# Altium schematic sheet VCO_core.SchDoc
size A3; Organization: Medical Technologies CZ a.s.; Version1: N/A; Version2: N/A; Version3: N/A; Change1description: N/A; Change2description: N/A; Change3description: N/A; Change1DrawnBy: N/A; Change2DrawnBy: N/A; Change3DrawnBy: N/A; Change1CheckedBy: N/A; Change2CheckedBy: N/A; Change3CheckedBy: N/A; PreviusVersion_Chng1: N/A; PreviusVersion_Chng2: N/A; PreviusVersion_Chng3: N/A; Variant1description: Standard assembly; Variant2description: N/A; Variant3description: N/A; Variant4description: N/A; PrimaryCard1: XXXxxxXXX; PrimaryCard2: N/A; PrimaryCard3: N/A; PrimaryCard4: N/A; DocumentName: Docname
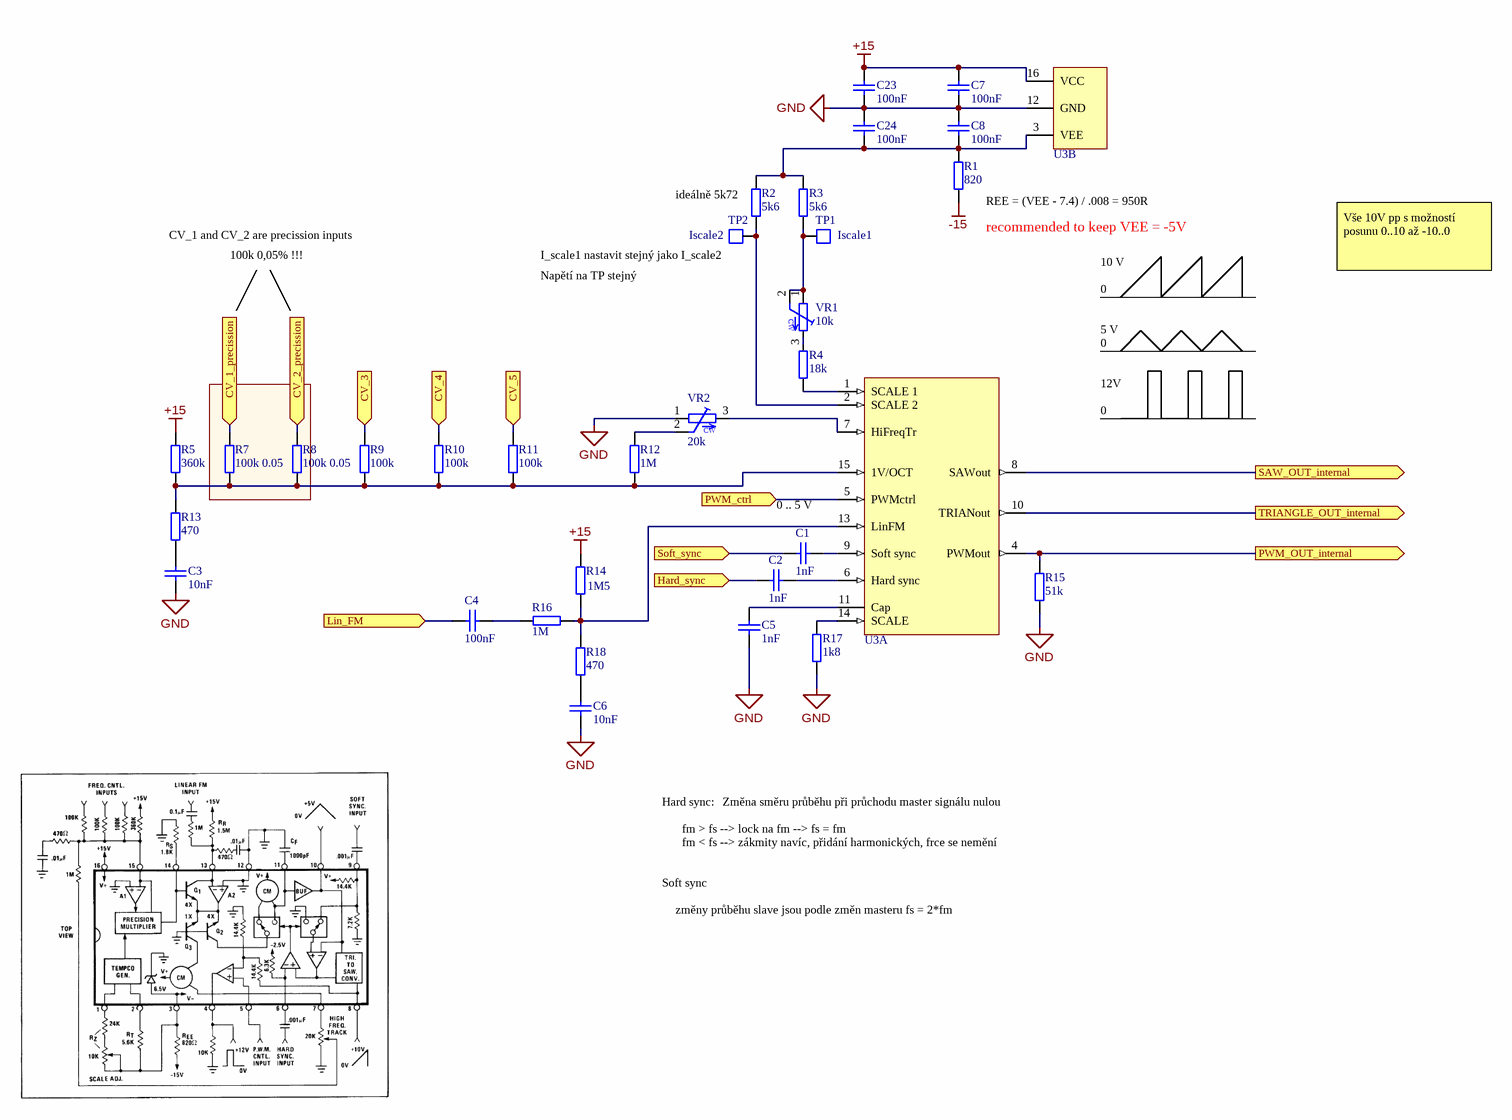
[diagram p0: VCO_core.SchDoc]

## Parts
C1  1nF  [WCAP-CSGP_0603_L1.6W0.8H0.8_Reflow]
C2  1nF  [WCAP-CSGP_0603_L1.6W0.8H0.8_Reflow]
C3  10nF  [WCAP-CSGP_0603_L1.6W0.8H0.8_Reflow]
C4  100nF  [WCAP-CSGP_0603_L1.6W0.8H0.8_Reflow]
C5  1nF  [WCAP-CSGP_0603_L1.6W0.8H0.8_Reflow]
C6  10nF  [WCAP-CSGP_0603_L1.6W0.8H0.8_Reflow]
C7  100nF  [WCAP-CSGP_0603_L1.6W0.8H0.8_Reflow]
C8  100nF  [WCAP-CSGP_0603_L1.6W0.8H0.8_Reflow]
C23  100nF  [WCAP-CSGP_0603_L1.6W0.8H0.8_Reflow]
C24  100nF  [WCAP-CSGP_0603_L1.6W0.8H0.8_Reflow]
R1  820  [RESC1608X06N(SMR0603)]
R2  5k6  [RESC1608X06N(SMR0603)]
R3  5k6  [RESC1608X06N(SMR0603)]
R4  18k  [RESC1608X06N(SMR0603)]
R5  360k  [RESC1608X06N(SMR0603)]
R7  100k 0.05  [RESC1608X06N(SMR0603)]
R8  100k 0.05  [RESC1608X06N(SMR0603)]
R9  100k  [RESC1608X06N(SMR0603)]
R10  100k  [RESC1608X06N(SMR0603)]
R11  100k  [RESC1608X06N(SMR0603)]
R12  1M  [RESC1608X06N(SMR0603)]
R13  470  [RESC1608X06N(SMR0603)]
R14  1M5  [RESC1608X06N(SMR0603)]
R15  51k  [RESC1608X06N(SMR0603)]
R16  1M  [RESC1608X06N(SMR0603)]
R17  1k8  [RESC1608X06N(SMR0603)]
R18  470  [RESC1608X06N(SMR0603)]
TP1  Iscale1  [TP_1.5_SMD_ROUND]  (no BOM)
TP2  Iscale2  [TP_1.5_SMD_ROUND]  (no BOM)
U3  CEM3340  [DIP-16]  (value not drawn)  (parts A,B of 2)
VR1  10k  [64W]
VR2  20k  [64W]

## Ports
CV_1_precission (in), CV_2_precission (in), CV_3 (in), CV_4 (in), CV_5 (in), Hard_sync (in), Lin_FM (in), PWM_ctrl (in), PWM_OUT_internal (out), SAW_OUT_internal (out), Soft_sync (in), TRIANGLE_OUT_internal (out)

## Nets
+15: C7.2 C23.2 R5.1 R14.2 U3.16(VCC)
-15: R1.1
GND: C3.2 C5.1 C6.1 C7.1 C8.2 C23.1 C24.2 R15.1 R17.1 U3.12(GND) VR2.1
CV_1_precission: R7.1 ; port CV_1_precission
CV_2_precission: R8.1 ; port CV_2_precission
CV_3: R9.1 ; port CV_3
CV_4: R10.1 ; port CV_4
CV_5: R11.1 ; port CV_5
Hard_sync: C2.1 ; port Hard_sync
Lin_FM: C4.1 ; port Lin_FM
PWM_ctrl: U3.5(PWMctrl) ; port PWM_ctrl
PWM_OUT_internal: R15.2 U3.4(PWMout) ; port PWM_OUT_internal
SAW_OUT_internal: U3.8(SAWout) ; port SAW_OUT_internal
Soft_sync: C1.1 ; port Soft_sync
TRIANGLE_OUT_internal: U3.10(TRIANout) ; port TRIANGLE_OUT_internal
NetC1_2: C1.2 U3.9(Soft_sync)
NetC2_2: C2.2 U3.6(Hard_sync)
NetC3_1: C3.1 R13.2
NetC4_2: C4.2 R16.2
NetC5_2: C5.2 U3.11(Cap)
NetC6_2: C6.2 R18.1
NetC8_1: C8.1 C24.1 R1.2 R2.2 R3.2 U3.3(VEE)
NetR2_1: R2.1 TP2.1 U3.2(SCALE_2)
NetR3_1: R3.1 TP1.1 VR1.1 VR1.2
NetR4_1: R4.1 VR1.3
NetR4_2: R4.2 U3.1(SCALE_1)
NetR5_2: R5.2 R7.2 R8.2 R9.2 R10.2 R11.2 R12.1 R13.1 U3.15(1V/OCT)
NetR12_2: R12.2 VR2.2
NetR14_1: R14.1 R16.1 R18.2 U3.13(LinFM)
NetR17_2: R17.2 U3.14(SCALE)
NetU3_7: U3.7(HiFreqTr) VR2.3

## Notes on the sheet
- (near R2) ideálně 5k72
- (near R1) REE = (VEE - 7.4) / .008 = 950R
- CV_1 and CV_2 are precission inputs
- 100k 0,05% !!!
- (near TP2) I_scale1 nastavit stejný jako I_scale2
- Napětí na TP stejný
- (near R1) recommended to keep VEE = -5V
- 10 V
- Vše 10V pp s možností posunu 0..10 až -10..0
- 0
- 5 V
- 12V
- 0 .. 5 V
- Hard sync:
- Změna směru průběhu při průchodu master signálu nulou
- Soft sync
- fm > fs --> lock na fm --> fs = fm
- fm < fs --> zákmity navíc, přidání harmonických, frce se nemění
- změny průběhu slave jsou podle změn masteru fs = 2*fm
- Číslo výkresu /drawing number/:
- Nazev listu/sheet name/:
- DPS projekt/PCB project/:
- Kreslil /drawn by/ :
- Kontroloval /checked by/:
- Schvalil /approved by/:
- Podpis /signature/:
- Datum /date/:
- List /sheet/:
- /
- (in symbol Trimmer universal 3/8 (10mm)) CW

## Library data of the parts
C1 C2 C5 = 885012006063: WCAP-CSGP Multilayer Ceramic Chip Capacitor, General Purpose, size 0603, NP0, 1nF, 50V; Manufacturer: Wurth Elektronik; Capacitance Tolerance: +/-5%; Isolation Resistance: 10GOhm; Q-Factor: 1000; Technical Reference: NP00603102J050DFCT10000; Capacitance: 1nF; Ceramic Type: NP0; ComponentLink1Description: Manufacturer Link; ComponentLink1URL: http://www.we-online.de; ComponentLink2Description: Datasheet; ComponentLink2URL: https://www.we-online.com/catalog/datasheet/885012006063.pdf; Height: 0.8mm; Length: 1.6mm; Manufacturer Part Number: 885012006063; Mounting Technology: SMT; Operating Temperature max.: 125C; Operating Temperature min.: -55C; Packaging: Tape and Reel; Rated Voltage: 50V; Size: 0603; Width: 0.8mm
C3 C6 = 885012206089: WCAP-CSGP Multilayer Ceramic Chip Capacitor, General Purpose, size 0603, X7R, 10nF, 50V; Manufacturer: Wurth Elektronik; Capacitance Tolerance: +/-10%; Dissipation Factor: 2.5%; Isolation Resistance: 10GOhm; Technical Reference: X7R0603103K050DFCT10000; Capacitance: 10nF; Ceramic Type: X7R; ComponentLink1Description: Manufacturer Link; ComponentLink1URL: http://www.we-online.de; ComponentLink2Description: Datasheet; ComponentLink2URL: https://www.we-online.com/catalog/datasheet/885012206089.pdf; Height: 0.8mm; Length: 1.6mm; Manufacturer Part Number: 885012206089; Mounting Technology: SMT; Operating Temperature max.: 125C; Operating Temperature min.: -55C; Packaging: Tape and Reel; Rated Voltage: 50V; Size: 0603; Width: 0.8mm
C4 C7 C8 C23 C24 = 885012206095: WCAP-CSGP Multilayer Ceramic Chip Capacitor, General Purpose, size 0603, X7R, 100nF, 50V; Manufacturer: Wurth Elektronik; Capacitance Tolerance: +/-10%; Dissipation Factor: 3%; Isolation Resistance: 5GOhm; Technical Reference: X7R0603104K050DFCT10000; Capacitance: 100nF; Ceramic Type: X7R; ComponentLink1Description: Manufacturer Link; ComponentLink1URL: http://www.we-online.de; ComponentLink2Description: Datasheet; ComponentLink2URL: https://www.we-online.com/catalog/datasheet/885012206095.pdf; Height: 0.8mm; Length: 1.6mm; Manufacturer Part Number: 885012206095; Mounting Technology: SMT; Operating Temperature max.: 125C; Operating Temperature min.: -55C; Packaging: Tape and Reel; Rated Voltage: 50V; Size: 0603; Width: 0.8mm
R1-R5 R9-R18 = R 0603 universal: Thick Film resistor, 0603 Size, universal value, 0.1 W; Tolerance & Rating: 1%/0.1W; Signal Integrity: Res; consumption: 0; RPP: 0,0188; Package: 0603; Simulation: Res; SMD: 1; ComponentLink1Description: ER+xxxx0.1W0603XXx_YageoEN100.pdf; ComponentLink1URL: i:\DataSheets\ER+xxxx0.1W0603XXx_YageoEN100.pdf; ComponentLink3Description: rezistor čip; ComponentLink3URL: heliosgreen://v1/hegMT/5-MT/Classes(343)/Folders/OpenForm?RecordNumbers=[6094847]
  R1: Value: 820
  R2 R3: Value: 5k6
  R4: Value: 18k
  R5: Value: 360k
  R9-R11: Value: 100k
  R12 R16: Value: 1M
  R13 R18: Value: 470
  R14: Value: 1M5
  R15: Value: 51k
  R17: Value: 1k8
R7 R8 = R 0603 universal: Precision Thick Film resistor, 0603 Size, universal value, 0.1 W; Tolerance & Rating: 0,05%/0.1W; Signal Integrity: Res; consumption: 0; RPP: 0,0188; Value: 100k 0.05; Package: 0603; Simulation: Res; SMD: 1; ComponentLink1Description: ER+xxxx0.1W0603XXx_YageoEN100.pdf; ComponentLink1URL: i:\DataSheets\ER+xxxx0.1W0603XXx_YageoEN100.pdf; ComponentLink3Description: rezistor čip; ComponentLink3URL: heliosgreen://v1/hegMT/5-MT/Classes(343)/Folders/OpenForm?RecordNumbers=[6094847]
TP1 TP2 = 000-TPSMT100: De; Test Point;; KK: 000-TPSMT100
U3 = CEM3340: ALFA RPAR AS3340 VCO (CEM3340)
VR1 VR2 = Trimmer universal 3/8 (10mm): 093 - 3/8" Square (10 mm) Multi-Turn Cermet Trimmer; KK: ERP-10K0.5WXX0; SMD: 0; ComponentLink1Description: Datasheet
  VR1: Value: 10k
  VR2: Value: 20k